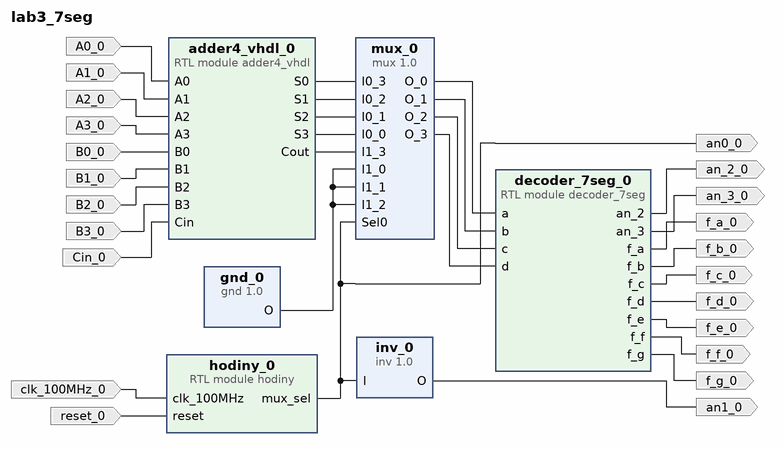
[diagram p0: block diagram of the top level]
# Vivado block design lab3_7seg, xc7a35tcpg236-1, Vivado 2018.3
create_bd_design lab3_7seg

create_bd_port -dir O an0_0
create_bd_port -dir O f_a_0
create_bd_port -dir O f_b_0
create_bd_port -dir O f_c_0
create_bd_port -dir O f_d_0
create_bd_port -dir O f_e_0
create_bd_port -dir O f_f_0
create_bd_port -dir O f_g_0
create_bd_port -dir I A0_0
create_bd_port -dir I A1_0
create_bd_port -dir I A2_0
create_bd_port -dir I A3_0
create_bd_port -dir I B0_0
create_bd_port -dir I B1_0
create_bd_port -dir I B2_0
create_bd_port -dir I B3_0
create_bd_port -dir I Cin_0
create_bd_port -dir I clk_100MHz_0
create_bd_port -dir I -type rst reset_0
set_property -dict {CONFIG.POLARITY ACTIVE_HIGH} [get_bd_ports reset_0]
create_bd_port -dir O an1_0
create_bd_port -dir O an_2_0
create_bd_port -dir O an_3_0

create_bd_cell -type module -reference adder4_vhdl adder4_vhdl_0
create_bd_cell -type module -reference hodiny hodiny_0
create_bd_cell -type ip -vlnv FIT:user:mux:1.0 mux_0
create_bd_cell -type ip -vlnv FIT:user:gnd:1.0 gnd_0
create_bd_cell -type ip -vlnv FIT:user:inv:1.0 inv_0
create_bd_cell -type module -reference decoder_7seg decoder_7seg_0

# ---- connections ----

connect_bd_net [get_bd_pins decoder_7seg_0/f_a] [get_bd_ports f_a_0]
connect_bd_net [get_bd_pins decoder_7seg_0/f_b] [get_bd_ports f_b_0]
connect_bd_net [get_bd_pins decoder_7seg_0/f_c] [get_bd_ports f_c_0]
connect_bd_net [get_bd_pins decoder_7seg_0/f_d] [get_bd_ports f_d_0]
connect_bd_net [get_bd_pins decoder_7seg_0/f_e] [get_bd_ports f_e_0]
connect_bd_net [get_bd_pins decoder_7seg_0/f_f] [get_bd_ports f_f_0]
connect_bd_net [get_bd_pins decoder_7seg_0/f_g] [get_bd_ports f_g_0]
connect_bd_net -net A0_0_1 [get_bd_ports A0_0] [get_bd_pins adder4_vhdl_0/A0]
connect_bd_net -net A1_0_1 [get_bd_ports A1_0] [get_bd_pins adder4_vhdl_0/A1]
connect_bd_net -net A2_0_1 [get_bd_ports A2_0] [get_bd_pins adder4_vhdl_0/A2]
connect_bd_net -net A3_0_1 [get_bd_ports A3_0] [get_bd_pins adder4_vhdl_0/A3]
connect_bd_net -net B0_0_1 [get_bd_ports B0_0] [get_bd_pins adder4_vhdl_0/B0]
connect_bd_net -net B1_0_1 [get_bd_ports B1_0] [get_bd_pins adder4_vhdl_0/B1]
connect_bd_net -net B2_0_1 [get_bd_ports B2_0] [get_bd_pins adder4_vhdl_0/B2]
connect_bd_net -net B3_0_1 [get_bd_ports B3_0] [get_bd_pins adder4_vhdl_0/B3]
connect_bd_net -net Cin_0_1 [get_bd_ports Cin_0] [get_bd_pins adder4_vhdl_0/Cin]
connect_bd_net -net clk_100MHz_0_1 [get_bd_ports clk_100MHz_0] [get_bd_pins hodiny_0/clk_100MHz]
connect_bd_net -net reset_0_1 [get_bd_ports reset_0] [get_bd_pins hodiny_0/reset]
connect_bd_net [get_bd_pins decoder_7seg_0/an_2] [get_bd_ports an_2_0]
connect_bd_net [get_bd_pins decoder_7seg_0/an_3] [get_bd_ports an_3_0]
connect_bd_net [get_bd_pins mux_0/O_0] [get_bd_pins decoder_7seg_0/a]
connect_bd_net [get_bd_pins mux_0/O_1] [get_bd_pins decoder_7seg_0/b]
connect_bd_net [get_bd_pins mux_0/O_2] [get_bd_pins decoder_7seg_0/c]
connect_bd_net [get_bd_pins mux_0/O_3] [get_bd_pins decoder_7seg_0/d]
connect_bd_net [get_bd_pins adder4_vhdl_0/S0] [get_bd_pins mux_0/I0_3]
connect_bd_net [get_bd_pins adder4_vhdl_0/S1] [get_bd_pins mux_0/I0_2]
connect_bd_net [get_bd_pins adder4_vhdl_0/S2] [get_bd_pins mux_0/I0_1]
connect_bd_net [get_bd_pins adder4_vhdl_0/S3] [get_bd_pins mux_0/I0_0]
connect_bd_net [get_bd_pins gnd_0/O] [get_bd_pins mux_0/I1_0] [get_bd_pins mux_0/I1_1] [get_bd_pins mux_0/I1_2]
connect_bd_net [get_bd_pins adder4_vhdl_0/Cout] [get_bd_pins mux_0/I1_3]
connect_bd_net [get_bd_pins inv_0/O] [get_bd_ports an1_0]
connect_bd_net [get_bd_pins hodiny_0/mux_sel] [get_bd_pins inv_0/I] [get_bd_pins mux_0/Sel0] [get_bd_ports an0_0]

validate_bd_design
save_bd_design
